# Altium project STC8a_Project.PrjPcb
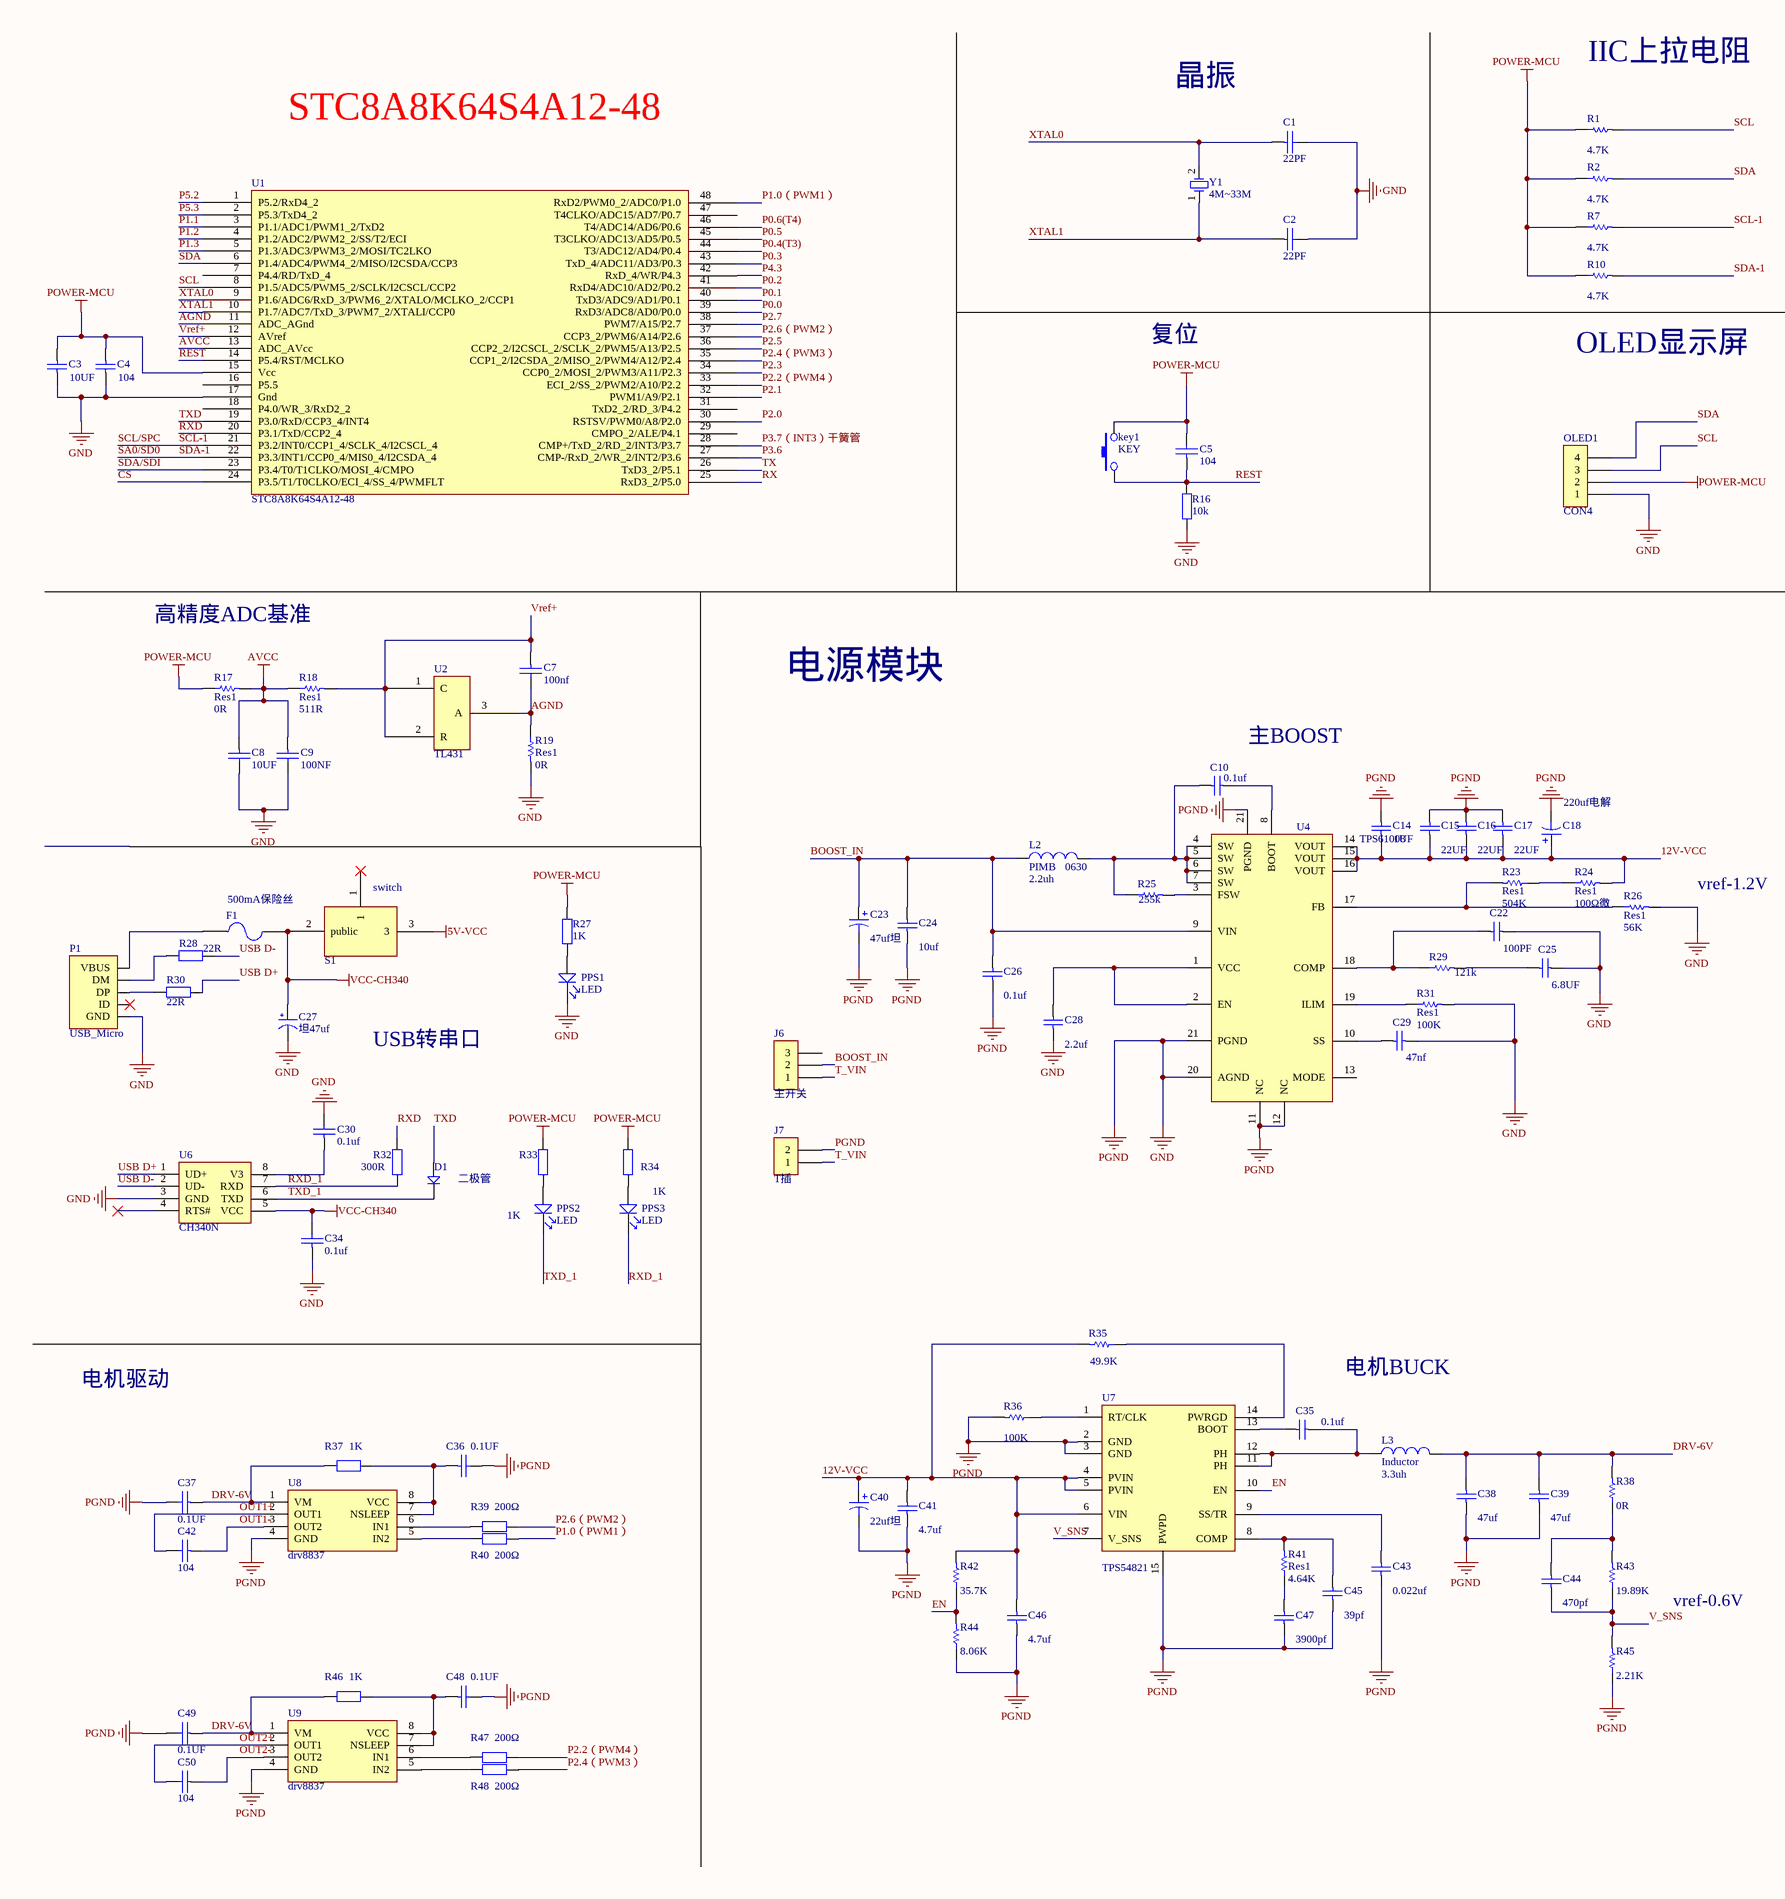
[diagram p0: STC8a.SchDoc, left]
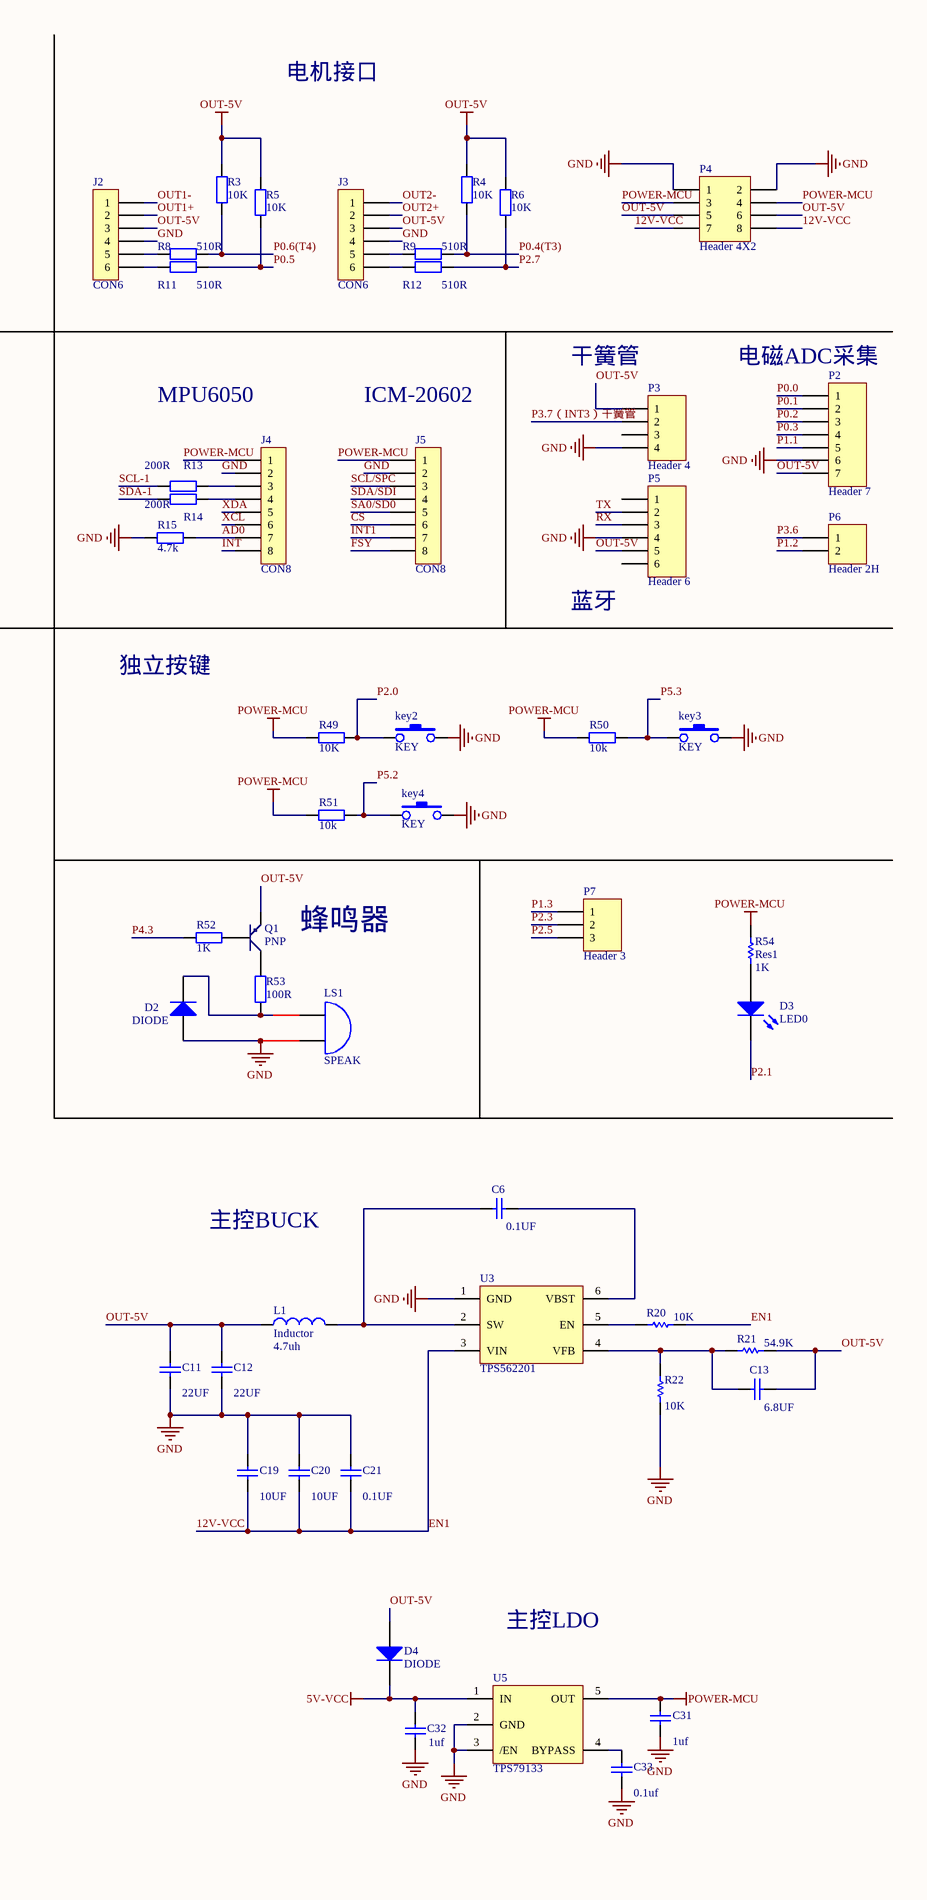
[diagram p1: STC8a.SchDoc, right]
1 sheet, 146 parts. Net scope: global (net labels, ports and power ports of the same name join across sheets).
Board files: STC8a.PcbDoc, PCB2.PcbDoc

## Sheet STC8a.SchDoc
size A2

### Parts
C1  22PF  [0603-C]
C2  22PF  [0603-C]
C3  value 10UF  [0603-C]
C4  value 104  [0603-C]
C5  104  [0603-C]
C6  value 0.1UF  [0603-c]
C7  100nf  [0603-C]
C8  10UF  [0603-C]
C9  100NF  [0603-C]
C10  value 0.1uf  [0603-c]
C11  value 22UF  [1206]
C12  value 22UF  [1206]
C13  value 6.8UF  [0603-c]
C14  value 1UF  [0805C]
C15  value 22UF  [1206]
C16  value 22UF  [1206]
C17  value 22UF  [1206]
C18  value 220uf电解  [CC88]
C19  value 10UF  [0805c]
C20  value 10UF  [0805c]
C21  value 0.1UF  [0805c]
C22  value 100PF  [0603-C]
C23  value 47uf坦  [1206]
C24  value 10uf  [0805-c]
C25  value 6.8UF  [0603-C]
C26  value 0.1uf  [0603-c]
C27  坦47uf  [0805-C]
C28  value 2.2uf  [0603-c]
C29  value 47nf  [0603-C]
C30  0.1uf  [0603-C]
C31  value 1uf  [0603-C]
C32  value 1uf  [0603-C]
C33  value 0.1uf  [0603-C]
C34  0.1uf  [0603-C]
C35  value 0.1uf  [0603-c]
C36  0.1UF  [0603-r]
C37  0.1UF  [0603-r]
C38  value 47uf  [1206]
C39  value 47uf  [1206]
C40  value 22uf坦  [1206]
C41  value 4.7uf  [0805c]
C42  104  [0603-r]
C43  value 0.022uf  [0603-r]
C44  value 470pf  [0603-c]
C45  value 39pf  [0603-c]
C46  value 4.7uf  [0805r]
C47  value 3900pf  [0603-c]
C48  0.1UF  [0603-r]
C49  0.1UF  [0603-r]
C50  104  [0603-r]
D1  二极管  [DIODE_SOP]
D2  DIODE  [DIODE_SOP - duplicate1]
D3  LED0  [0805-LED]
D4  DIODE  [DIODE_SOP - duplicate1]
F1  500mA保险丝  [0805 - duplicate]
J2  CON6  [XH6-1.5x1.5]
J3  CON6  [XH6-1.5x1.5]
J4  CON8  [HDR1X8]
J5  CON8  [HDR1X8]
J6  主开关  [拨动开关]
J7  T插  [T型头]
key1  KEY  [KEY]
key2  KEY  [KEY]
key3  KEY  [KEY]
key4  KEY  [KEY]
L1  Inductor  value 4.7uh  [L8*8]
L2  PIMB   0630  value 2.2uh  [L8*8]
L3  Inductor  value 3.3uh  [L8*8]
LS1  SPEAK  [BELL-5]
OLED1  CON4  [HDR1X4]
P1  USB_Micro  [USB_MINI - duplicate]
P2  Header 7  [HDR1X7]
P3  Header 4  [HDR1X4]
P4  Header 4X2  [HDR2X4]
P5  Header 6  [HDR1X6]
P6  Header 2H  [HDR1X2]
P7  Header 3  [HDR1X3]
PPS1  LED  [0805-LED]
PPS2  LED  [0805-LED]
PPS3  LED  [0805-LED]
Q1  PNP  [SOT-23R]
R1  value 4.7K  [0603-R]
R2  value 4.7K  [0603-R]
R3  10K  [0603-R]
R4  10K  [0603-R]
R5  10K  [0603-R]
R6  10K  [0603-R]
R7  value 4.7K  [0603-R]
R8  510R  [0603-R]
R9  510R  [0603-R]
R10  value 4.7K  [0603-R]
R11  510R  [0603-R]
R12  510R  [0603-R]
R13  200R  [0603-R]
R14  200R  [0603-R]
R15  4.7k  [0603-R]
R16  10k  [0603-R]
R17  Res1  value 0R  [0603-R]
R18  Res1  value 511R  [0603-R]
R19  Res1  value 0R  [0603-R]
R20  value 10K  [0603-r]
R21  value 54.9K  [0603-r]
R22  value 10K  [0603-r]
R23  Res1  value 504K  [0603-R]
R24  Res1  value 100Ω微  [0603-R]
R25  value 255k  [0603-r]
R26  Res1  value 56K  [0603-R]
R27  1K  [0603-R]
R28  22R  [0603-R]
R29  value 121k  [0603-R]
R30  22R  [0603-R]
R31  Res1  value 100K  [0603-R]
R32  300R  [0603-R]
R33  1K  [0603-R]
R34  1K  [0603-R]
R35  value 49.9K  [0603-r]
R36  value 100K  [0603-r]
R37  1K  [0603-r]
R38  value 0R  [0603-r]
R39  200Ω  [0603-r]
R40  200Ω  [0603-r]
R41  Res1  value 4.64K  [0603-r]
R42  value 35.7K  [0603-r]
R43  value 19.89K  [0603-r]
R44  value 8.06K  [0603-r]
R45  value 2.21K  [0603-r]
R46  1K  [0603-r]
R47  200Ω  [0603-r]
R48  200Ω  [0603-r]
R49  10K  [0603-R]
R50  10k  [0603-R]
R51  10k  [0603-R]
R52  1k  [0603-R]
R53  100R  [0603-R]
R54  Res1  value 1K  [0603-R]
S1  switch  [HDR1X3]
U1  STC8A8K64S4A12-48  [LQFP48S]
U2  TL431  [SOT-23]
U3  TPS562201  [LC-SOT-23-6]
U4  TPS61008  [TPS61088改]
U5  TPS79133  [LC-SOT-23-5]
U6  CH340N  [SOP-8]
U7  TPS54821  [VQFN-14改]
U8  drv8837  [wson-8-2X2改]
U9  drv8837  [wson-8-2X2改]
Y1  value 4M~33M  [XTAL_5032]  (hidden comment: XTAL_5032)

### Nets
5V-VCC: C32.2 D4.2(K) S1.3 U5.1(IN)
AVCC: C8.1 C9.1 R17.2 R18.1 U1.13(ADC_AVcc)
GND: C1.2 C2.2 C3.1 C4.1 C8.2 C9.2 C11.1 C12.1 C14.1 C15.1 C16.1 C17.1 C18.2 C19.2 C20.2 C21.2 C22.2 C23.2 C24.1 C25.2 C26.1 C27.2(GND) C28.1 C29.2 C30.2 C31.1 C32.1 C33.1 C34.1 C36.2 C37.2 C38.1 C39.1 C40.2 C41.1 C43.1 C45.1 C46.1 C47.1 C48.2 C49.2 D2.1(A) J2.4 J3.4 J4.2 J5.2 J7.2 key2.2 key3.2 key4.2 LS1.2(B) OLED1.1 P1.5(GND) P2.6 P3.4 P4.1 P4.2 P5.4 PPS1.2 R15.2 R16.1 R19.2 R22.1 R26.2 R31.2 R36.2 R44.1 R45.1 U1.17(Gnd) U3.1(GND) U4.11(NC) U4.12(NC) U4.20(AGND) U4.21(PGND) U5.2(GND) U5.3(/EN) U6.3(GND) U7.2(GND) U7.3(GND) U7.15(PWPD) U8.4(GND) U9.4(GND)  [also labelled PGND]
OUT-5V: C11.2 C12.2 C13.2 D4.1(A) J2.3 J3.3 L1.1 P2.7 P3.1 P4.5 P4.6 P5.5 Q1.1(E) R3.1 R4.1 R5.1 R6.1 R21.2
POWER-MCU: C3.2 C4.2 C5.2 C31.2 J4.1 J5.1 key1.2 OLED1.2 P4.3 P4.4 R1.1 R2.1 R7.1 R10.1 R17.1 R27.1 R33.2 R34.2 R49.1 R50.1 R51.1 R54.2 U1.15(Vcc) U5.5(OUT)
VCC-CH340: C27.1(VCC) C34.2 F1.2 S1.2(public) U6.5(VCC)
12V-VCC: C14.2 C15.2 C16.2 C17.2 C18.1 C19.1 C20.1 C21.1 C40.1 C41.2 C46.2 P4.7 P4.8 R20.2 R24.2 R35.2 R42.2 U3.3(VIN) U4.14(VOUT) U4.15(VOUT) U4.16(VOUT) U7.4(PVIN) U7.5(PVIN) U7.6(VIN)  [also labelled EN1]
AD0: J4.7 R15.1
AGND: C7.2 R19.1 U1.11(ADC_AGnd) U2.3(A)
BOOST_IN: C23.1 C24.2 C26.2 J6.2 L2.1 U4.9(VIN)
CS: J5.6 U1.24(P3.5/T1/T0CLKO/ECI_4/SS_4/PWMFLT)
DRV-6V: C37.1 C38.2 C39.2 C49.1 L3.2 R37.2 R38.2 R46.2 U8.1(VM) U9.1(VM)
EN: R42.1 R44.2 U7.10(EN)
FSY: J5.8
INT: J4.8
INT1: J5.7
OUT1+: C42.2 J2.2 U8.2(OUT1)
OUT1-: C42.1 J2.1 U8.3(OUT2)
OUT2+: C50.2 J3.2 U9.2(OUT1)
OUT2-: C50.1 J3.1 U9.3(OUT2)
P0.0: P2.1 U1.39(RxD3/ADC8/AD0/P0.0)
P0.1: P2.2 U1.40(TxD3/ADC9/AD1/P0.1)
P0.2: P2.3 U1.41(RxD4/ADC10/AD2/P0.2)
P0.3: P2.4 U1.43(TxD_4/ADC11/AD3/P0.3)
P0.4(T3): R4.2 R9.2 U1.44(T3/ADC12/AD4/P0.4)
P0.5: R5.2 R11.2 U1.45(T3CLKO/ADC13/AD5/P0.5)
P0.6(T4): R3.2 R8.2 U1.46(T4/ADC14/AD6/P0.6)
P1.0（PWM1）: R40.1 U1.48(RxD2/PWM0_2/ADC0/P1.0)
P1.1: P2.5 U1.3(P1.1/ADC1/PWM1_2/TxD2)
P1.2: P6.2 U1.4(P1.2/ADC2/PWM2_2/SS/T2/ECI)
P1.3: P7.1 U1.5(P1.3/ADC3/PWM3_2/MOSI/TC2LKO)
P2.0: key2.1 R49.2 U1.30(RSTSV/PWM0/A8/P2.0)
P2.1: D3.2(K) U1.32(PWM1/A9/P2.1)
P2.2（PWM4）: R47.1 U1.33(ECI_2/SS_2/PWM2/A10/P2.2)
P2.3: P7.2 U1.34(CCP0_2/MOSI_2/PWM3/A11/P2.3)
P2.4（PWM3）: R48.1 U1.35(CCP1_2/I2CSDA_2/MISO_2/PWM4/A12/P2.4)
P2.5: P7.3 U1.36(CCP2_2/I2CSCL_2/SCLK_2/PWM5/A13/P2.5)
P2.6（PWM2）: R39.1 U1.37(CCP3_2/PWM6/A14/P2.6)
P2.7: R6.2 R12.2 U1.38(PWM7/A15/P2.7)
P3.6: P6.1 U1.27(CMP-/RxD_2/WR_2/INT2/P3.6)
P3.7（INT3）干簧管: P3.2 U1.28(CMP+/TxD_2/RD_2/INT3/P3.7)
P4.3: R52.2 U1.42(RxD_4/WR/P4.3)
P5.2: key4.1 R51.2 U1.1(P5.2/RxD4_2)
P5.3: key3.1 R50.2 U1.2(P5.3/TxD4_2)
REST: C5.1 key1.1 R16.2 U1.14(P5.4/RST/MCLKO)
RX: P5.3 U1.25(RxD3_2/P5.0)
RXD: R32.2 U1.20(P3.1/TxD/CCP2_4)
RXD_1: PPS3.2 R32.1 U6.7(RXD)
SA0/SD0: J5.5 R10.2 R14.2 U1.22(P3.3/INT1/CCP0_4/MIS0_4/I2CSDA_4)  [also labelled SDA-1]
SCL: OLED1.3 R1.2 U1.8(P1.5/ADC5/PWM5_2/SCLK/I2CSCL/CCP2)
SCL-1: J5.3 R7.2 R13.2 U1.21(P3.2/INT0/CCP1_4/SCLK_4/I2CSCL_4)  [also labelled SCL/SPC]
SDA: OLED1.4 R2.2 U1.6(P1.4/ADC4/PWM4_2/MISO/I2CSDA/CCP3)
SDA/SDI: J5.4 U1.23(P3.4/T0/T1CLKO/MOSI_4/CMPO)
T_VIN: J6.1 J7.1
TX: P5.2 U1.26(TxD3_2/P5.1)
TXD: D1.1 U1.19(P3.0/RxD/CCP3_4/INT4)
TXD_1: D1.2 PPS2.2 U6.6(TXD)
USB D+: R30.2 U6.1(UD+)
USB D-: R28.2 U6.2(UD-)
V_SNS: C44.1 R43.1 R45.2 U7.7(V_SNS)
Vref+: C7.1 R18.2 U1.12(AVref) U2.1(C) U2.2(R)
XCL: J4.6
XDA: J4.5
XTAL0: C1.1 U1.9(P1.6/ADC6/RxD_3/PWM6_2/XTALO/MCLKO_2/CCP1) Y1.2(OSC2)
XTAL1: C2.1 U1.10(P1.7/ADC7/TxD_3/PWM7_2/XTALI/CCP0) Y1.1(OSC1)
NetC6_1: C6.1 L1.2 U3.2(SW)
NetC6_2: C6.2 U3.6(VBST)
NetC10_1: C10.1 U4.8(BOOT)
NetC10_2: C10.2 L2.2 R25.1 U4.4(SW) U4.5(SW) U4.6(SW) U4.7(SW)
NetC13_1: C13.1 R21.1 R22.2 U3.4(VFB)
NetC22_1: C22.1 R29.1 U4.18(COMP)
NetC25_1: C25.1 R29.2
NetC28_2: C28.2 U4.1(VCC) U4.2(EN)
NetC29_1: C29.1 U4.10(SS)
NetC30_1: C30.1 U6.8(V3)
NetC33_2: C33.2 U5.4(BYPASS)
NetC35_1: C35.1 L3.1 U7.11(PH) U7.12(PH)
NetC35_2: C35.2 U7.13(BOOT)
NetC36_1: C36.1 R37.1 U8.7(NSLEEP) U8.8(VCC)
NetC43_2: C43.2 U7.9(SS/TR)
NetC44_2: C44.2 R38.1 R43.2
NetC45_2: C45.2 R41.2 U7.8(COMP)
NetC47_2: C47.2 R41.1
NetC48_1: C48.1 R46.1 U9.7(NSLEEP) U9.8(VCC)
NetD2_2: D2.2(K) LS1.1(A) R53.2
NetD3_1: D3.1(A) R54.1
NetF1_1: F1.1 P1.1(VBUS)
NetJ2_5: J2.5 R8.1
NetJ2_6: J2.6 R11.1
NetJ3_5: J3.5 R9.1
NetJ3_6: J3.6 R12.1
NetJ4_3: J4.3 R13.1
NetJ4_4: J4.4 R14.1
NetP1_2: P1.2(DM) R28.1
NetP1_3: P1.3(DP) R30.1
NetPPS1_1: PPS1.1 R27.2
NetPPS2_1: PPS2.1 R33.1
NetPPS3_1: PPS3.1 R34.1
NetQ1_2: Q1.2(B) R52.1
NetQ1_3: Q1.3(C) R53.1
NetR20_1: R20.1 U3.5(EN)
NetR23_1: R23.1 R24.1
NetR23_2: R23.2 R26.1 U4.17(FB)
NetR25_2: R25.2 U4.3(FSW)
NetR31_1: R31.1 U4.19(ILIM)
NetR35_1: R35.1 U7.14(PWRGD)
NetR36_1: R36.1 U7.1(RT/CLK)
NetR39_2: R39.2 U8.6(IN1)
NetR40_2: R40.2 U8.5(IN2)
NetR47_2: R47.2 U9.6(IN1)
NetR48_2: R48.2 U9.5(IN2)

Not connected (* = marked no-connect by the designer): J6 3; P1 4(ID)*; P3 3; P5 1 6; S1 1*; U1 7(P4.4/RD/TxD_4) 16(P5.5) 18(P4.0/WR_3/RxD2_2) 29(CMPO_2/ALE/P4.1) 31(TxD2_2/RD_3/P4.2) 47(T4CLKO/ADC15/AD7/P0.7); U4 13(MODE); U6 4(RTS#)*

### Notes on the sheet
- 晶振
- IIC上拉电阻
- 电机接口
- STC8A8K64S4A12-48
- 复位
- 干簧管
- (near P2) 电磁ADC采集
- OLED显示屏
- MPU6050
- ICM-20602
- 蓝牙
- 高精度ADC基准
- 独立按键
- 电源模块
- (near C10) 主BOOST
- vref-1.2V
- 蜂鸣器
- USB转串口
- 主控BUCK
- 电机BUCK
- 电机驱动
- 主控LDO
- vref-0.6V

### Library data of the parts
C1 C2 C5 C36 C37 C42 C48-C50 = CAP_0805
C3 C4 C6 C10-C17 C19-C22 C24-C26 C28 C29 C31-C33 C35 C38 C39 C41 C43-C47 = Cap: Capacitor; Published: 8-Jun-2000; LatestRevisionDate: 17-Jul-2002; LatestRevisionNote: Re-released for DXP Platform.; PackageReference: RAD-0.3; Publisher: Altium Limited; PackageDescription: Radial Cap, Thru-Hole; 2 Leads; 0.3 in Pin Spacing
C7-C9 C27 C30 C34 = CAP
C18 C23 C40 = Cap Pol1: Polarized Capacitor (Radial); Published: 8-Jun-2000; LatestRevisionDate: 17-Jul-2002; LatestRevisionNote: Re-released for DXP Platform.; PackageReference: RB7.6-15; Publisher: Altium Limited; PackageDescription: Polarized Capacitor (Radial); 2 Leads
D1 = D_1: 1N4148
D2 D4 = Diode_1_2: Default Diode; Published: 8-Jun-2000; LatestRevisionDate: 17-Jul-2002; LatestRevisionNote: Re-released for DXP Platform.; PackageVersion: Sep-1996; PackageReference: SMC; Publisher: Altium Limited; PackageDescription: DO-214-AB/SMC; 2 C-Bend Leads; Body 7.9 x 5.9 mm, inc. leads (LxW); Code_JEDEC: DO-214-AB
D3 = LED0: Typical INFRARED GaAs LED; Published: 8-Jun-2000; LatestRevisionDate: 08-Jul-2005; LatestRevisionNote: Mech Layer 1 removed.; PackageReference: LED-0; Publisher: Altium Limited; PackageDescription: LED; 2 Leads
F1 = Fuse 2: Fuse; Published: 8-Jun-2000; LatestRevisionDate: 17-Jul-2002; LatestRevisionNote: Re-released for DXP Platform.; PackageReference: PIN-W2/E2.8; Publisher: Altium Limited; PackageDescription: Thru-Hole; 2 Leads
J6 = CON3
J7 = CON2
L1-L3 = Inductor: Code_IEC: 1005; Published: 8-Jun-2000; LatestRevisionDate: 29-May-2009; LatestRevisionNote: IPC-7351 Footprint Added.; PackageReference: 0402-A; Publisher: Altium Limited; PackageDescription: Chip Inductor; Code_JEITA: 0402
LS1 = SPEAK: Electrical Bell; Published: 24-Mar-1999; LatestRevisionDate: 17-Jul-2002; LatestRevisionNote: Re-released for DXP Platform.; PackageReference: PIN2; Publisher: Altium Limited
P1 = USB_Micro: USB
P2 = Header 7: Header, 7-Pin; LatestRevisionDate: 17-Jul-2002; LatestRevisionNote: Re-released for DXP Platform.; Publisher: Altium Limited
P3 = Header 4: Header, 4-Pin; LatestRevisionDate: 17-Jul-2002; LatestRevisionNote: Re-released for DXP Platform.; Publisher: Altium Limited
P4 = Header 4X2: Header, 4-Pin, Dual row; LatestRevisionDate: 17-Jul-2002; LatestRevisionNote: Re-released for DXP Platform.; Publisher: Altium Limited
P5 = Header 6: Header, 6-Pin; LatestRevisionDate: 17-Jul-2002; LatestRevisionNote: Re-released for DXP Platform.; Publisher: Altium Limited
P6 = Header 2H: Header, 2-Pin, Right Angle; LatestRevisionDate: 17-Jul-2002; LatestRevisionNote: Re-released for DXP Platform.; Publisher: Altium Limited
P7 = Header 3: Header, 3-Pin; LatestRevisionDate: 17-Jul-2002; LatestRevisionNote: Re-released for DXP Platform.; Publisher: Altium Limited
Q1 = PNP_5: 8550/BCW68
R1 R2 R7 R10 R17-R26 R29 R31 R35 R36 R38 R41-R45 R54 = Res1: Resistor; Published: 8-Jun-2000; LatestRevisionDate: 17-Jul-2002; LatestRevisionNote: Re-released for DXP Platform.; PackageReference: AXIAL-0.3; Publisher: Altium Limited; PackageDescription: Axial Device, Thru-Hole; 2 Leads; 0.3 in Pin Spacing
R3-R6 R8 R9 R11-R16 R27 R28 R30 R32-R34 R37 R39 R40 R46-R51 = RES: Resistor; Published: 8-Jun-2000; LatestRevisionDate: 17-Jul-2002; LatestRevisionNote: Re-released for DXP Platform.; PackageReference: AXIAL-0.4; Publisher: Altium Limited; PackageDescription: Axial Device, Thru-Hole; 2 Leads; 0.4 in Pin Spacing
R52 R53 = Res_0603: Resistor
  R52: Value: 1K
  R53: Value: 100R
S1 = SW DPDT: Published: 24-Mar-1999; LatestRevisionDate: 29-May-2009; LatestRevisionNote: IPC-7351 Footprint Added.; PackageVersion: Mar-2001; PackageReference: SOT23-6; Publisher: Altium Limited; PackageDescription: 6-Pin SOT-23 Package 0.95 mm Pitch, 2.7 mm Lead Span; Code_JEITA: SC-74; Code_IPC: SOT26A-6
U8 U9 = DRV8837DSGR
Y1 = XTAL_5032: Crystal Oscillator; Published: 8-Jun-2000; LatestRevisionDate: 17-Jul-2002; LatestRevisionNote: Re-released for DXP Platform.; PackageReference: R38; Publisher: Altium Limited; PackageDescription: Crystal, Thru-Hole; 2 Leads; Body 3.1 x 8.2 mm (Dia.xH)